# Altium schematic sheet Flynk.SchDoc
size A4
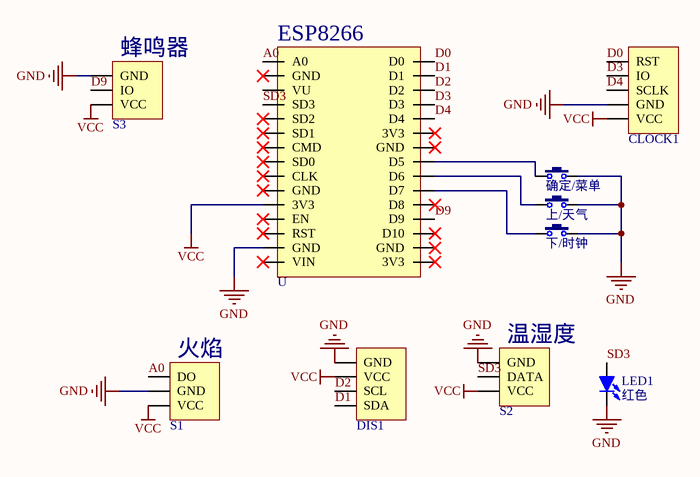
[diagram p0: Flynk.SchDoc]

## Parts
CLOCK1  HDR-1X5  [HDR2.54-M-LI-5P]  (value not drawn)
DIS1  HDR-1X4  [HDR2.54-M-LI-4P]  (value not drawn)
LED1  红色  [LED 5MM-R]
S1  HDR-1X3  [HDR2.54-M-LI-3P]  (value not drawn)
S2  HDR-1X3  [HDR2.54-M-LI-3P]  (value not drawn)
S3  蜂鸣器  [HDR2.54-M-LI-3P]  (value not drawn)
U  HDR-1X15  [HDR2.54-M-LI-15P -NodeMCU]  (value not drawn)
上/天气  3x6x5  [TSW DIP-3*6*4.3]  (value not drawn)
下/时钟  3x6x5  [TSW DIP-3*6*4.3]  (value not drawn)
确定/菜单  3x6x5  [TSW DIP-3*6*4.3]  (value not drawn)

## Nets
GND: CLOCK1.4(GND) DIS1.1(GND) LED1.2(K) S1.2(GND) S2.1(GND) S3.1(GND) U.14(GND) 上/天气.2 下/时钟.2 确定/菜单.2
VCC: CLOCK1.5(VCC) DIS1.2(VCC) S1.3(VCC) S2.3(VCC) S3.3(VCC) U.11(3V3)
A0: S1.1(DO) U.1(A0)
D0: CLOCK1.1(RST) U.16(D0)
D1: DIS1.4(SDA) U.17(D1)
D2: DIS1.3(SCL) U.18(D2)
D3: CLOCK1.2(IO) U.19(D3)
D4: CLOCK1.3(SCLK) U.20(D4)
D9: S3.2(IO) U.27(D9)
SD3: LED1.1(A) S2.2(DATA) U.4(SD3)
NetU_23: U.23(D5) 确定/菜单.1
NetU_24: U.24(D6) 上/天气.1
NetU_25: U.25(D7) 下/时钟.1

Not connected (* = marked no-connect by the designer): U 2(GND)* 3(VU) 5(SD2)* 6(SD1)* 7(CMD)* 8(SD0)* 9(CLK)* 10(GND)* 12(EN)* 13(RST)* 15(VIN)* 21(3V3)* 22(GND)* 26(D8)* 28(D10)* 29(GND)* 30(3V3)*

## Notes on the sheet
- (in symbol DHT11温湿度器) 温湿度
- (in symbol NodeMCU) ESP8266
- (in symbol 火焰传感器) 火焰

## Library data of the parts
CLOCK1 = RTC时钟芯片: 5P排针-排母; BOM名称: 5P接插件; 版权归属: 源创客; 学习资源: www.ooocke.com
DIS1 = OLED128x64: 4P排针-排母; BOM名称: 4P接插件; 版权归属: 源创客; 学习资源: www.ooocke.com
LED1 = LED-5MM: 5mm插件LED; 版权归属: 源创客; BOM名称: 5mm插件LED; 学习资源: www.ooocke.com
S1 = 火焰传感器: 3P排针-排母; BOM名称: 3P接插件; 版权归属: 源创客; 学习资源: www.ooocke.com
S2 = DHT11温湿度器: 3P排针-排母; BOM名称: 3P接插件; 版权归属: 源创客; 学习资源: www.ooocke.com
S3 = 蜂鸣器: 3P排针-排母; BOM名称: 3P接插件; 版权归属: 源创客; 学习资源: www.ooocke.com
U = NodeMCU: Node-MCU; BOM名称: 15P接插件; 版权归属: 源创客; 学习资源: www.ooocke.com
上/天气 下/时钟 确定/菜单 = TSW 3x6: 3x6轻触开关; 版权归属: 源创客; BOM名称: 3x6轻触开关; 学习资源: www.ooocke.com